# EAGLE schematic osd (EAGLE 5.11)
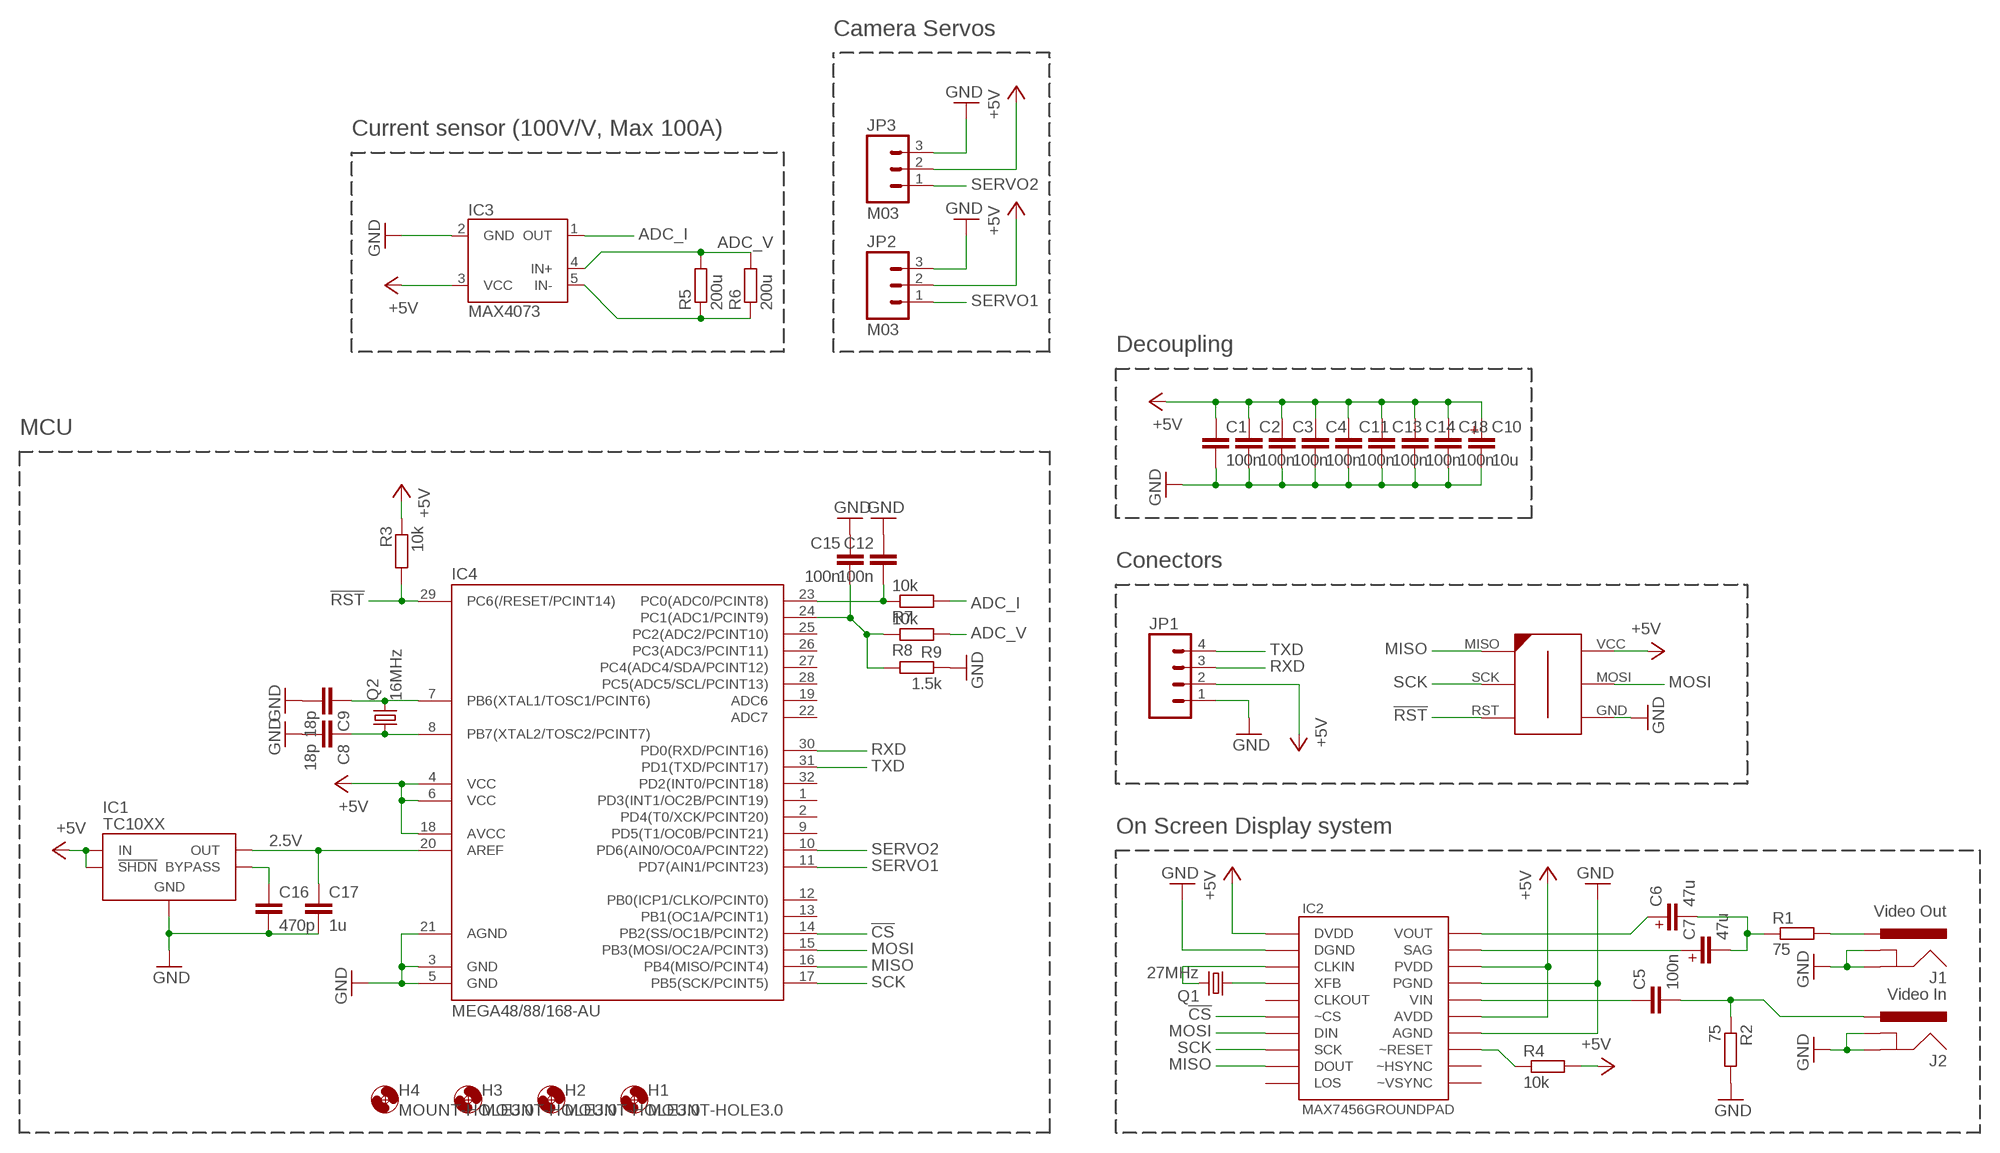
[diagram p0: schematic, sheet 1]

## Parts
C1  100n  C-EUC0603  [C0603]
C2  100n  C-EUC0603  [C0603]
C3  100n  C-EUC0603  [C0603]
C4  100n  C-EUC0603  [C0603]
C5  100n  C-EUC0603  [C0603]
C6  47u  C-EUC1206  [C1206]
C7  47u  C-EUC1206  [C1206]
C8  18p  C-EUC0603  [C0603]
C9  18p  C-EUC0603  [C0603]
C10  10u  C-EUC1206  [C1206]
C11  100n  C-EUC0603  [C0603]
C12  100n  C-EUC0603  [C0603]
C13  100n  C-EUC0603  [C0603]
C14  100n  C-EUC0603  [C0603]
C15  100n  C-EUC0603  [C0603]
C16  470p  C-EUC0603  [C0603]
C17  1u  C-EUC0603  [C0603]
C18  100n  C-EUC0603  [C0603]
H1  MOUNT-HOLE3.0  [3,0]
H2  MOUNT-HOLE3.0  [3,0]
H3  MOUNT-HOLE3.0  [3,0]
H4  MOUNT-HOLE3.0  [3,0]
IC1  TC10XX  [SOT23-5]
IC2  MAX7456GROUNDPAD  [TSSOP28-GROUNDPAD]
IC3  MAX4073  [SC70-5]
IC4  MEGA48/88/168-AU  [TQFP32-08]
J1  Video Out  POWER_JACKRCA  [RCA]
J2  Video In  POWER_JACKRCA  [RCA]
JP1  S04_SURFACE  [S04_SURFACE]
JP2  M03  [M03]
JP3  M03  [M03]
Q1  27MHz  CRYSTAL5X3  [CRYSTAL-SMD-5X3]
Q2  16MHz  CRYSTAL5X3  [CRYSTAL-SMD-5X3]
R1  75  R-EU_R0603  [R0603]
R2  75  R-EU_R0603  [R0603]
R3  10k  R-EU_R0603  [R0603]
R4  10k  R-EU_R0603  [R0603]
R5  200u  R-EU_R2512  [R2512]
R6  200u  R-EU_R2512  [R2512]
R7  10k  R-EU_R0603  [R0603]
R8  10k  R-EU_R0603  [R0603]
R9  1.5k  R-EU_R0603  [R0603]
U$1  AVR-ISP-6-EDGE  [6PAD_ISP]

## Nets
!CS: IC2.8(~CS) IC4.14(PB2(SS/OC1B/PCINT2))
!RST: IC4.29(PC6(/RESET/PCINT14)) R3.2 U$1.RST
+5V: C1.1 C2.1 C3.1 C4.1 C10.1 C11.1 C13.1 C14.1 C18.1 IC1.1(IN) IC1.3(!SHDN) IC2.3(DVDD) IC2.21(AVDD) IC2.24(PVDD) IC3.3(VCC) IC4.4(VCC) IC4.6(VCC) IC4.18(AVCC) JP1.2 JP2.2 JP3.2 R3.1 R4.2 U$1.VCC
ADC_I: IC3.1(OUT) R7.2
ADC_V: IC3.4(IN+) R5.2 R6.2 R8.2
GND: C1.2 C2.2 C3.2 C4.2 C8.2 C9.2 C10.2 C11.2 C12.1 C13.2 C14.2 C15.1 C16.2 C17.2 C18.2 IC1.2(GND) IC2.4(DGND) IC2.20(AGND) IC2.23(PGND) IC3.2(GND) IC4.3(GND) IC4.5(GND) IC4.21(AGND) J1.BARREL(GND) J1.SPRING(GNDBREAK) J2.BARREL(GND) J2.SPRING(GNDBREAK) JP1.1 JP2.3 JP3.3 R2.2 R9.1 U$1.GND
MISO: IC2.11(DOUT) IC4.16(PB4(MISO/PCINT4)) U$1.MISO
MOSI: IC2.9(DIN) IC4.15(PB3(MOSI/OC2A/PCINT3)) U$1.MOSI
N$1: C5.1 IC2.22(VIN)
N$2: C6.1 IC2.26(VOUT)
N$3: C7.1 IC2.25(SAG)
N$4: J1.BREAK(PWR) R1.2
N$5: C6.2 C7.2 R1.1
N$6: C5.2 J2.BREAK(PWR) R2.1
N$7: IC2.19(~RESET) R4.1
N$8: C8.1 IC4.8(PB7(XTAL2/TOSC2/PCINT7)) Q2.1
N$9: C9.1 IC4.7(PB6(XTAL1/TOSC1/PCINT6)) Q2.3
N$10: IC2.6(XFB) Q1.1
N$11: IC3.5(IN-) R5.1 R6.1
N$12: IC2.5(CLKIN) Q1.3
N$13: C16.1 IC1.4(BYPASS)
N$14: C12.2 IC4.23(PC0(ADC0/PCINT8)) R7.1
N$15: C17.1 IC1.5(OUT) IC4.20(AREF)
N$18: C15.2 IC4.24(PC1(ADC1/PCINT9)) R8.1 R9.2
RXD: IC4.30(PD0(RXD/PCINT16)) JP1.3
SCK: IC2.10(SCK) IC4.17(PB5(SCK/PCINT5)) U$1.SCK
SERVO1: IC4.11(PD7(AIN1/PCINT23)) JP2.1
SERVO2: IC4.10(PD6(AIN0/OC0A/PCINT22)) JP3.1
TXD: IC4.31(PD1(TXD/PCINT17)) JP1.4
Unconnected: IC2.7(CLKOUT) IC2.12(LOS) IC2.17(~VSYNC) IC2.18(~HSYNC) IC4.1(PD3(INT1/OC2B/PCINT19)) IC4.2(PD4(T0/XCK/PCINT20)) IC4.9(PD5(T1/OC0B/PCINT21)) IC4.12(PB0(ICP1/CLKO/PCINT0)) IC4.13(PB1(OC1A/PCINT1)) IC4.19(ADC6) IC4.22(ADC7) IC4.25(PC2(ADC2/PCINT10)) IC4.26(PC3(ADC3/PCINT11)) IC4.27(PC4(ADC4/SDA/PCINT12)) IC4.28(PC5(ADC5/SCL/PCINT13)) IC4.32(PD2(INT0/PCINT18))

## Notes on the sheet
- Camera Servos
- Current sensor (100V/V, Max 100A)
- Decoupling
- +
- MCU
- Conectors
- On Screen Display system
- 2.5V
- +
- +

## Library data of the parts
C1-C18 = rcl:C-EU: CAPACITOR, European symbol
H1-H4 = holes:MOUNT-HOLE: MOUNTING HOLE with drill center marker
IC1 = korken:TC10XX
IC2 = SparkFun:MAX7456
IC3 = korken:MAX4073
IC4 = avr-6:MEGA48/88/168
J1 J2 = SparkFun:POWER_JACK: Power Jack This is the standard 5.5mm barrel jack for power. The PTH is the most common, proven, reliable, footprint. All others are experimental. The Slot footprint only works if the mill layer is transmitted to the PCB fab house so be warned. Spark Fun Electronics SKU : PRT-00119. Mating wall wart : TOL-00298 (and others)
JP1 = korken:S04_SURFACE
JP2 JP3 = korken:M03
Q1 Q2 = SparkFun:CRYSTAL: Crystals Various standard crystals. Proven footprints. Spark Fun Electronics SKU : COM-00534
R1-R9 = rcl:R-EU_: RESISTOR, European symbol
U$1 = avr-5-4.16:AVR-ISP-6-EDGE: 6 pin edge connector for ISP with ATMEL MCUs. Developed by Craig Moates (craig at moates dot net). Library by David Blundell (blundar at gmail dot com). Often, even a 6 pin header is really inconvenient for board layout and/or production. This SMD-only header is our de-facto standard for using an edge connector for programming with the help of a 6pin/10pin to edge card adapter.